# EAGLE design arduino clone (EAGLE 9.1.0)

## Sheet 1 of 4
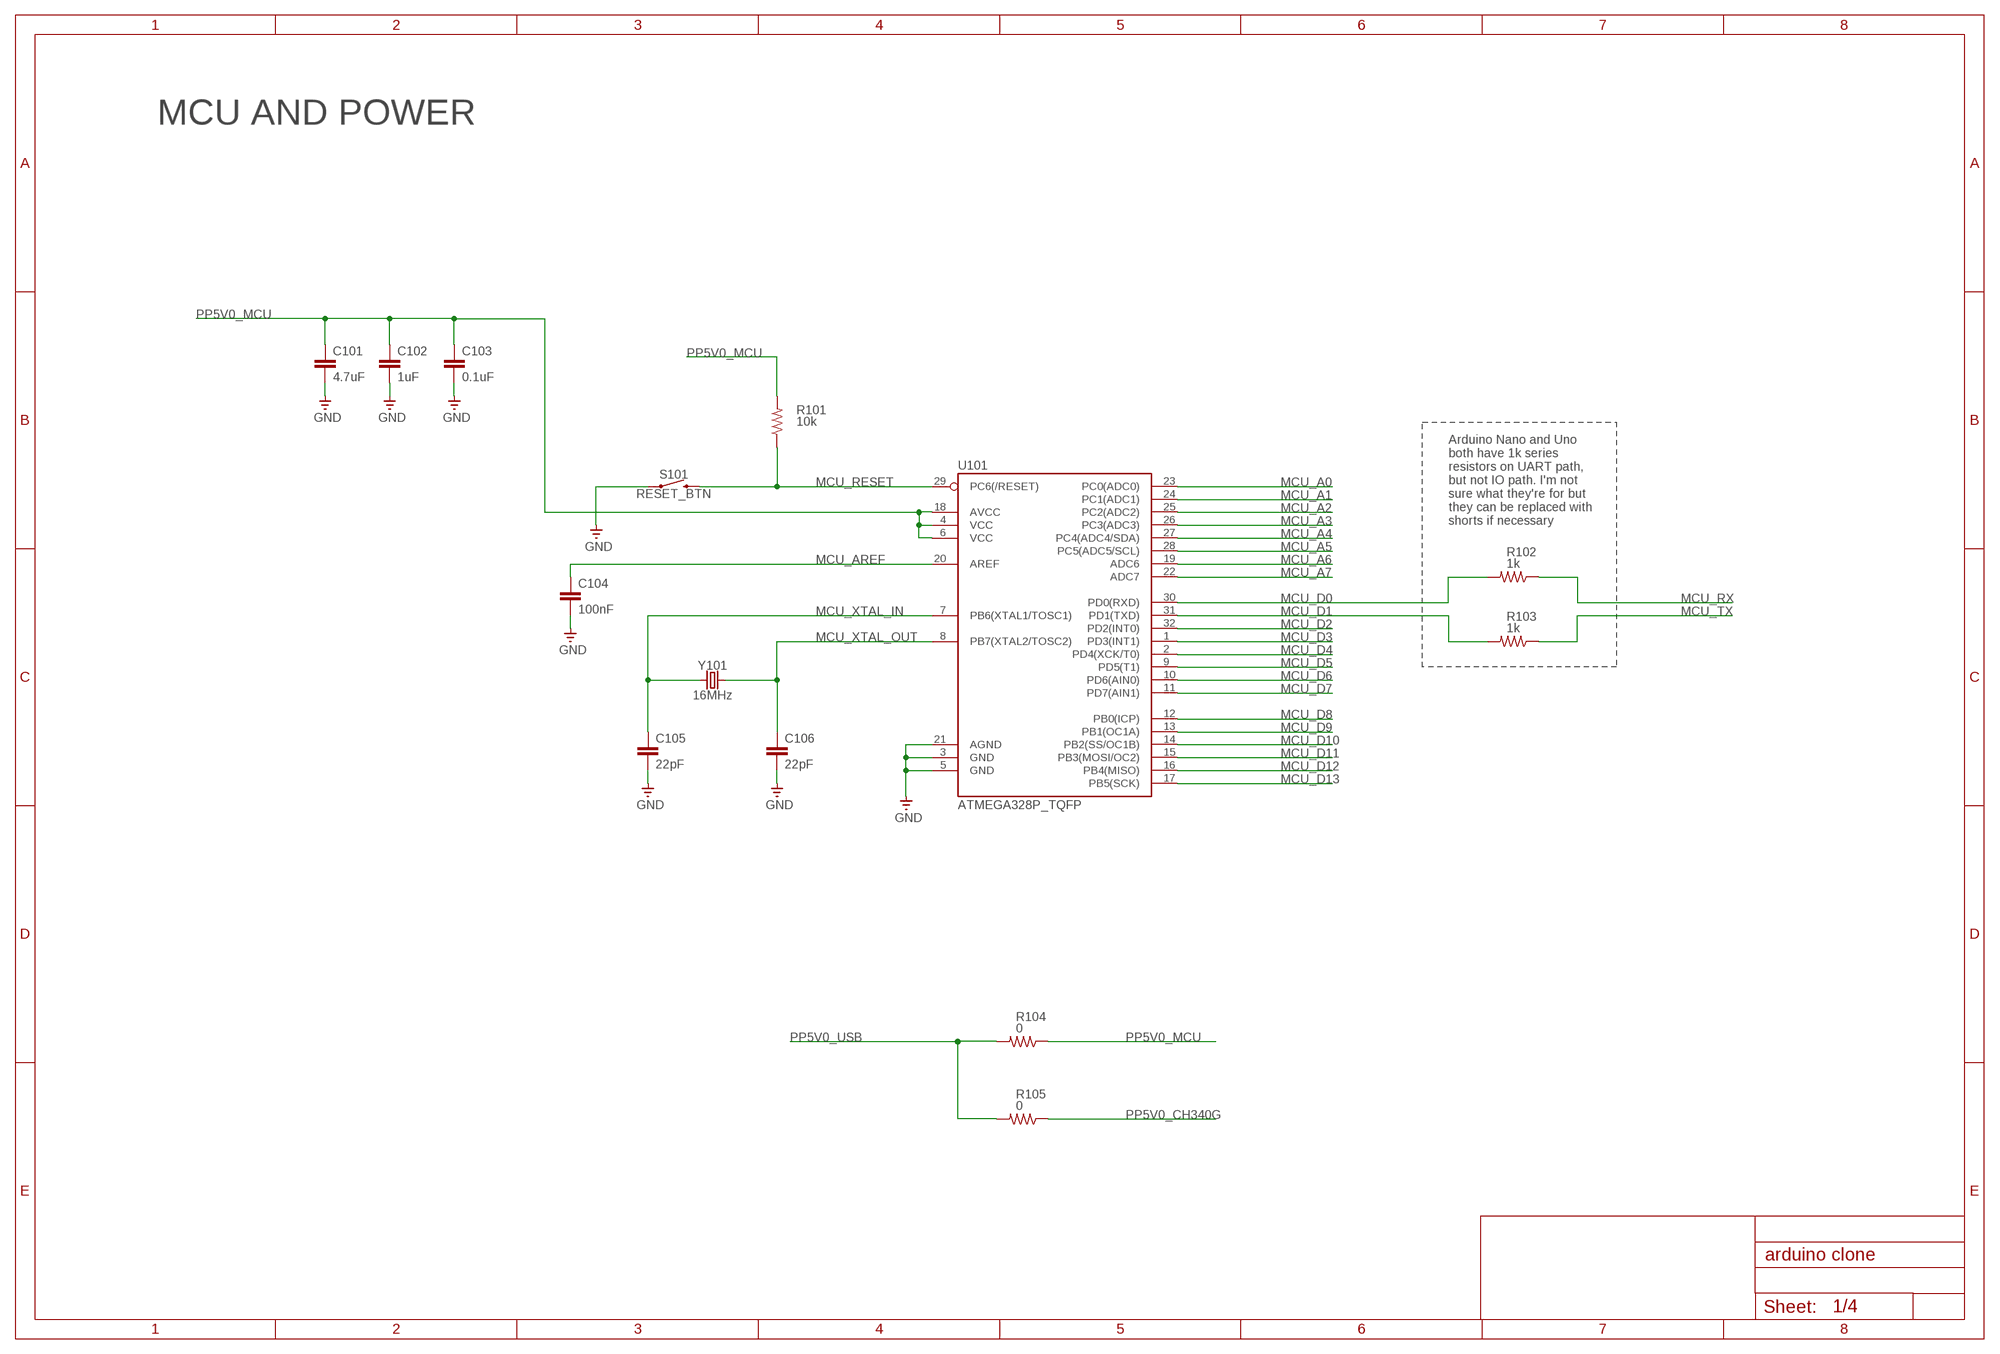
[diagram p0: schematic, sheet 1]

### Parts
C101  4.7uF  C-EUC0805  [C0805]
C102  1uF  C-EUC0805  [C0805]
C103  0.1uF  C-EUC0805  [C0805]
C104  100nF  C-EUC0805  [C0805]
C105  22pF  C-EUC0805  [C0805]
C106  22pF  C-EUC0805  [C0805]
R101  10k  R-US_R0805  [R0805]
R102  1k  R-US_R0805  [R0805]
R103  1k  R-US_R0805  [R0805]
R104  0  R-US_R0805  [R0805]
R105  0  R-US_R0805  [R0805]
S101  RESET_BTN  MOMENTARY-SWITCH-SPST-SMD-6.2MM-TALL  [TACTILE_SWITCH_SMD_6.2MM_TALL]
U101  ATMEGA328P_TQFP  [TQFP32-08]
Y101  16MHz  CRYSTAL-16MHZSMD-5X3.2  [CRYSTAL-SMD-5X3.2-4PAD]

### Nets
GND: C101.2 C102.2 C103.2 C104.2 C105.2 C106.2 S101.A2 U101.3(GND) U101.5(GND) U101.21(AGND) ; also sheet 2,3,4
MCU_A0: U101.23(PC0(ADC0)) ; also sheet 2
MCU_A1: U101.24(PC1(ADC1)) ; also sheet 2
MCU_A2: U101.25(PC2(ADC2)) ; also sheet 2
MCU_A3: U101.26(PC3(ADC3)) ; also sheet 2
MCU_A4: U101.27(PC4(ADC4/SDA)) ; also sheet 2
MCU_A5: U101.28(PC5(ADC5/SCL)) ; also sheet 2
MCU_A6: U101.19(ADC6) ; also sheet 2
MCU_A7: U101.22(ADC7) ; also sheet 2
MCU_AREF: C104.1 U101.20(AREF) ; also sheet 2
MCU_D0: R102.2 U101.30(PD0(RXD)) ; also sheet 2
MCU_D1: R103.2 U101.31(PD1(TXD)) ; also sheet 2
MCU_D2: U101.32(PD2(INT0)) ; also sheet 2
MCU_D3: U101.1(PD3(INT1)) ; also sheet 2
MCU_D4: U101.2(PD4(XCK/T0)) ; also sheet 2
MCU_D5: U101.9(PD5(T1)) ; also sheet 2
MCU_D6: U101.10(PD6(AIN0)) ; also sheet 2
MCU_D7: U101.11(PD7(AIN1)) ; also sheet 2
MCU_D8: U101.12(PB0(ICP)) ; also sheet 2
MCU_D9: U101.13(PB1(OC1A)) ; also sheet 2
MCU_D10: U101.14(PB2(SS/OC1B)) ; also sheet 2
MCU_D11: U101.15(PB3(MOSI/OC2)) ; also sheet 2
MCU_D12: U101.16(PB4(MISO)) ; also sheet 2
MCU_D13: U101.17(PB5(SCK)) ; also sheet 2
MCU_RESET: R101.1 S101.B2 U101.29(PC6(/RESET)) ; also sheet 2,3,4
MCU_RX: R102.1 ; also sheet 3,4
MCU_TX: R103.1 ; also sheet 3,4
MCU_XTAL_IN: C105.1 U101.7(PB6(XTAL1/TOSC1)) Y101.1
MCU_XTAL_OUT: C106.1 U101.8(PB7(XTAL2/TOSC2)) Y101.3
PP5V0_CH340G: R105.1 ; also sheet 3
PP5V0_MCU: C101.1 C102.1 C103.1 R101.2 R104.1 U101.4(VCC) U101.6(VCC) U101.18(AVCC) ; also sheet 2,4
PP5V0_USB: R104.2 R105.2 ; also sheet 2,3,4

### Notes on the sheet
- MCU AND POWER
- Arduino Nano and Uno 
  both have 1k series 
  resistors on UART path, 
  but not IO path. I'm not 
  sure what they're for but 
  they can be replaced with 
  shorts if necessary

## Sheet 2 of 4
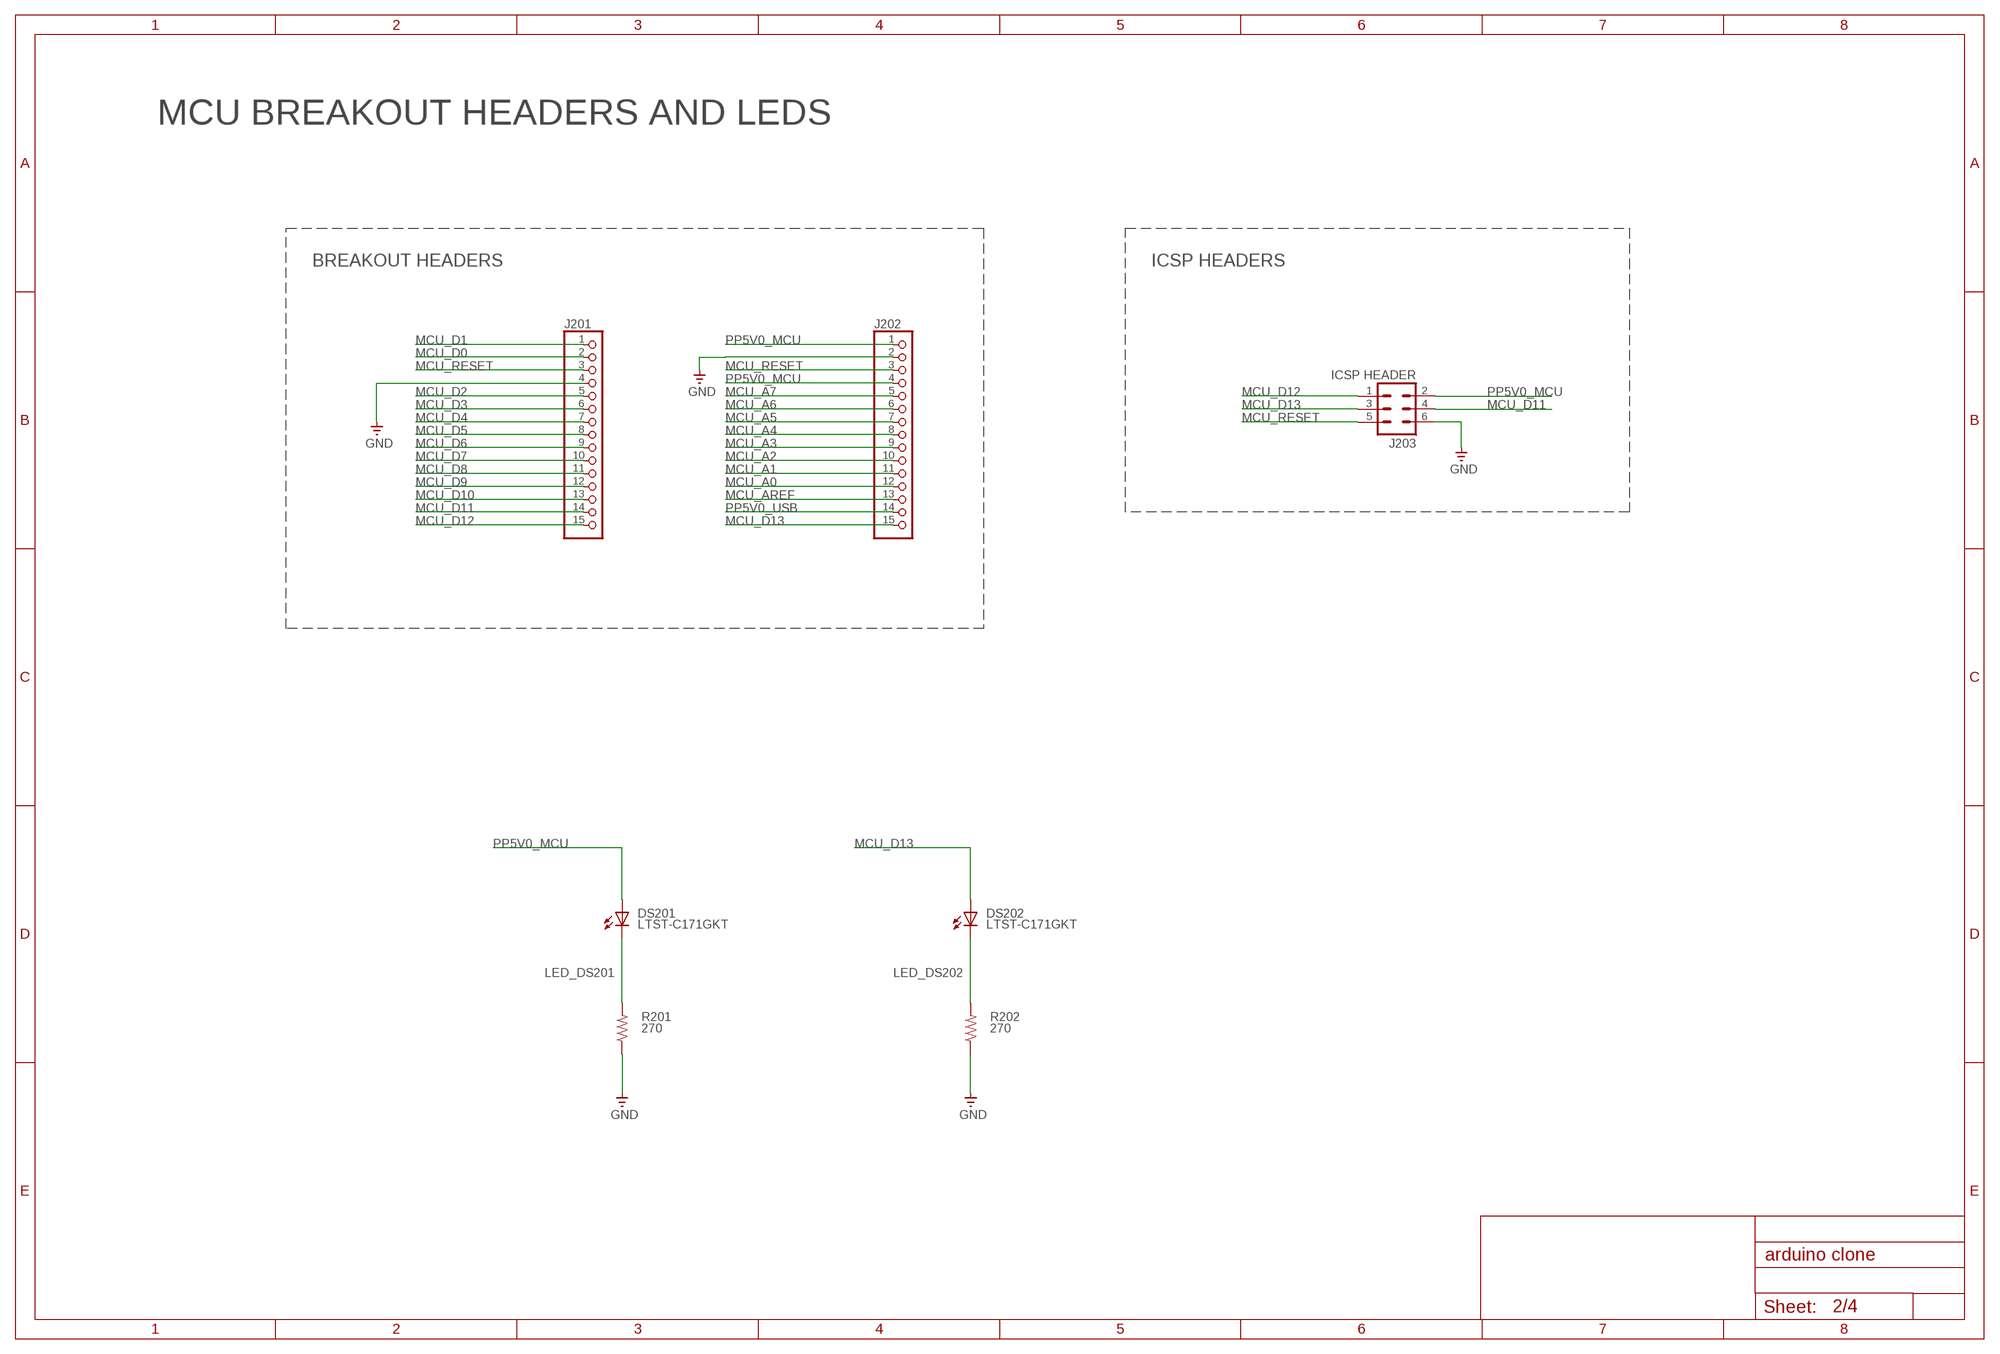
[diagram p1: schematic, sheet 2]

### Parts
DS201  LTST-C171GKT  LEDCHIPLED_0805  [CHIPLED_0805]
DS202  LTST-C171GKT  LEDCHIPLED_0805  [CHIPLED_0805]
J201  PINHD-1X15-CB  [1X15-CB]
J202  PINHD-1X15-CB  [1X15-CB]
J203  ICSP HEADER  MA03-2  [MA03-2]
R201  270  R-US_M0805  [M0805]
R202  270  R-US_M0805  [M0805]

### Nets
GND: J201.4 J202.2 J203.6 R201.1 R202.1 ; also sheet 1,3,4
LED_DS201 [BATT_POWER]: DS201.C R201.2
LED_DS202 [BATT_POWER]: DS202.C R202.2
MCU_A0: J202.12 ; also sheet 1
MCU_A1: J202.11 ; also sheet 1
MCU_A2: J202.10 ; also sheet 1
MCU_A3: J202.9 ; also sheet 1
MCU_A4: J202.8 ; also sheet 1
MCU_A5: J202.7 ; also sheet 1
MCU_A6: J202.6 ; also sheet 1
MCU_A7: J202.5 ; also sheet 1
MCU_AREF: J202.13 ; also sheet 1
MCU_D0: J201.2 ; also sheet 1
MCU_D1: J201.1 ; also sheet 1
MCU_D2: J201.5 ; also sheet 1
MCU_D3: J201.6 ; also sheet 1
MCU_D4: J201.7 ; also sheet 1
MCU_D5: J201.8 ; also sheet 1
MCU_D6: J201.9 ; also sheet 1
MCU_D7: J201.10 ; also sheet 1
MCU_D8: J201.11 ; also sheet 1
MCU_D9: J201.12 ; also sheet 1
MCU_D10: J201.13 ; also sheet 1
MCU_D11: J201.14 J203.4 ; also sheet 1
MCU_D12: J201.15 J203.1 ; also sheet 1
MCU_D13: DS202.A J202.15 J203.3 ; also sheet 1
MCU_RESET: J201.3 J202.3 J203.5 ; also sheet 1,3,4
PP5V0_MCU: DS201.A J202.1 J202.4 J203.2 ; also sheet 1,4
PP5V0_USB: J202.14 ; also sheet 1,3,4

### Notes on the sheet
- MCU BREAKOUT HEADERS AND LEDS
- BREAKOUT HEADERS | ICSP HEADERS

## Sheet 3 of 4
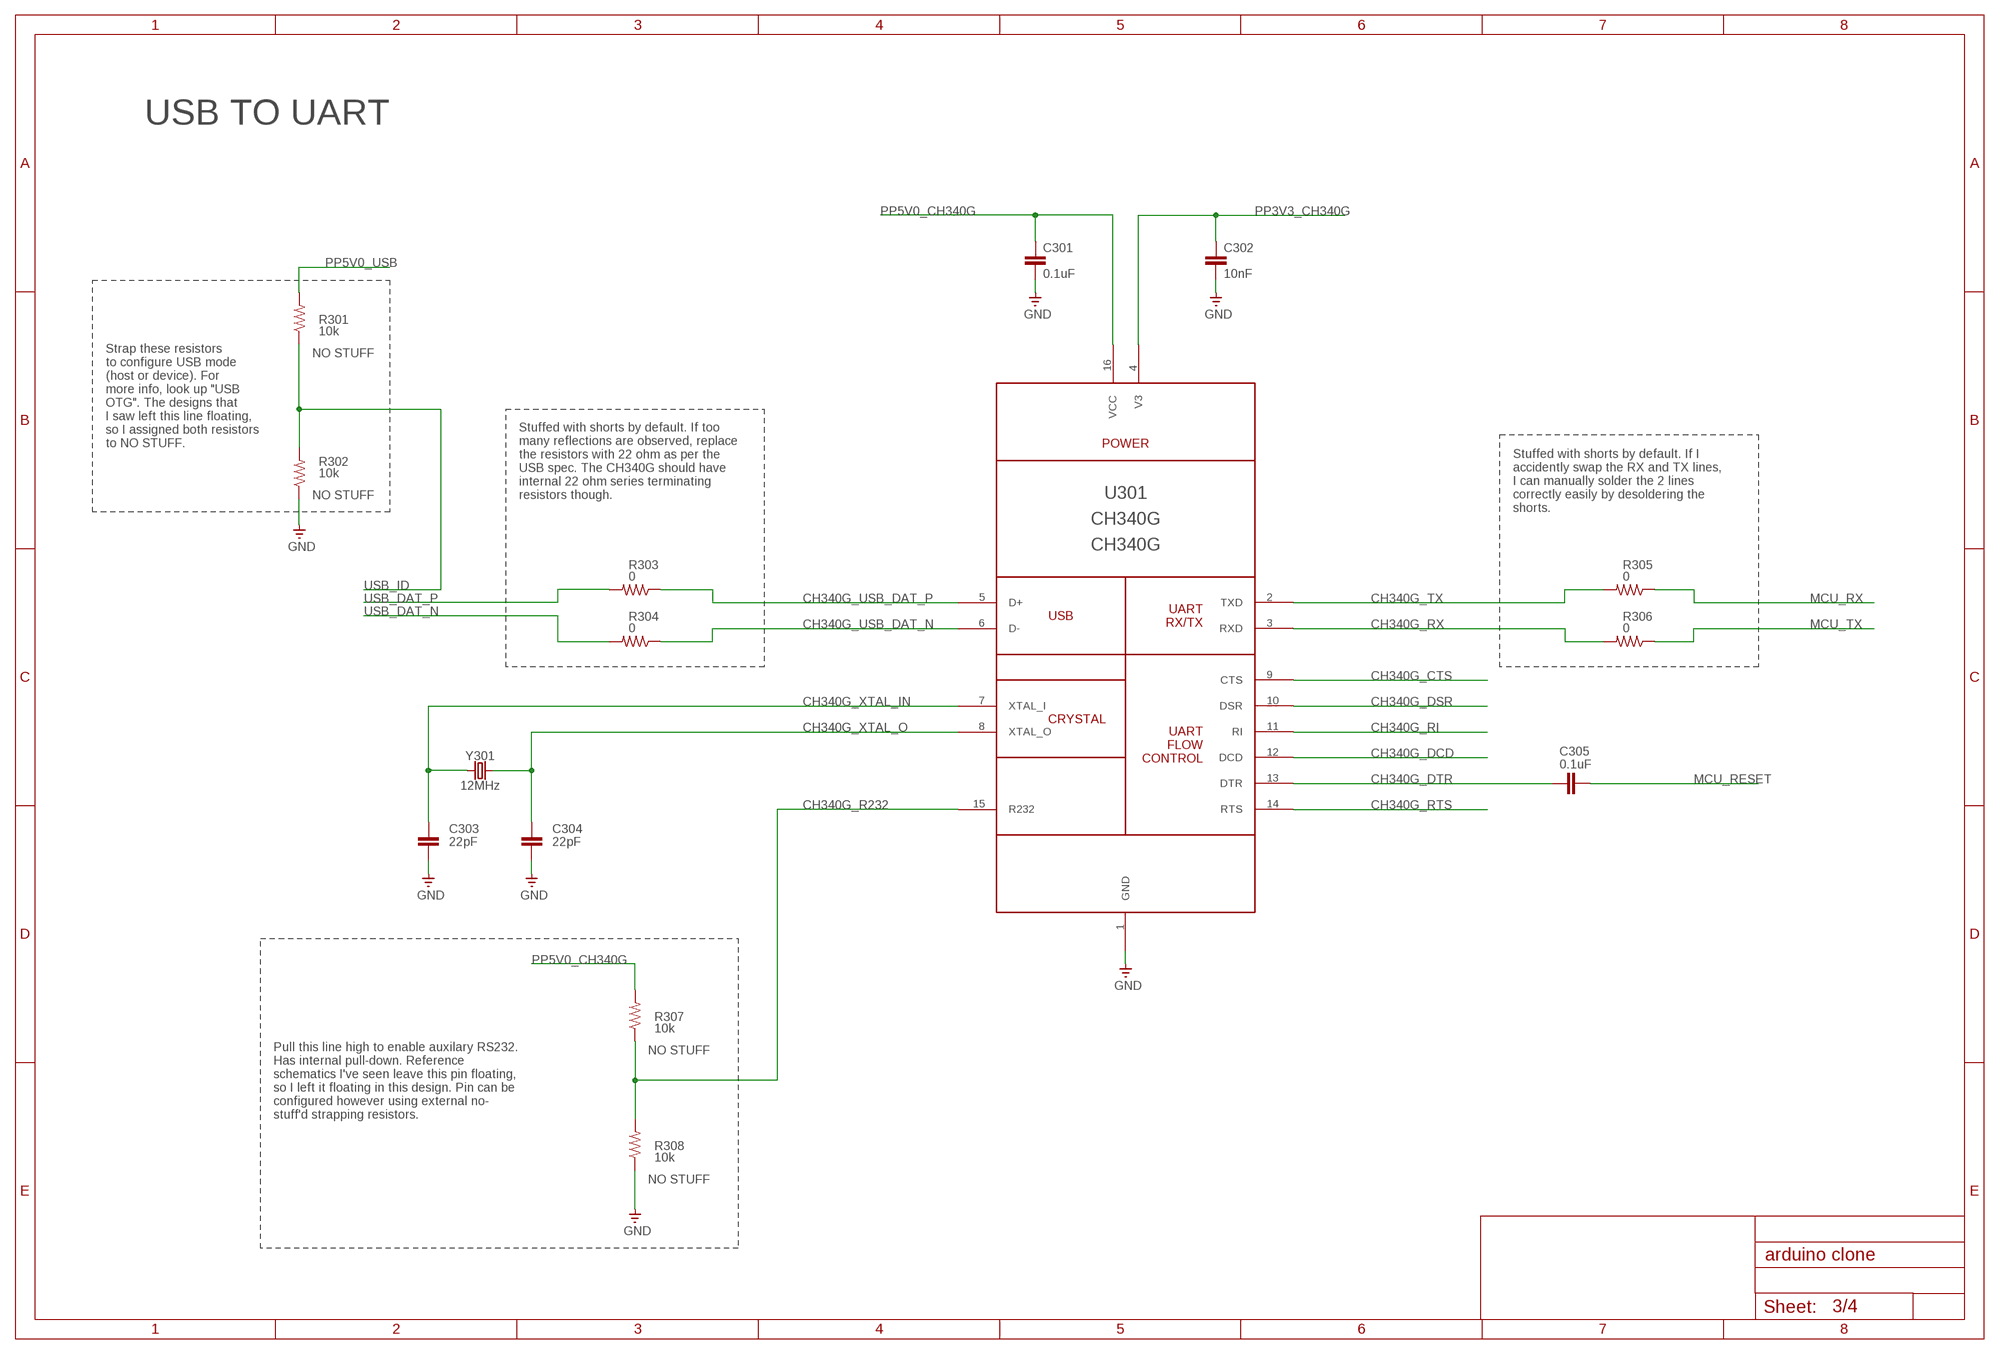
[diagram p2: schematic, sheet 3]

### Parts
C301  0.1uF  C-EUC0805  [C0805]
C302  10nF  C-EUC0805  [C0805]
C303  22pF  C-EUC0805  [C0805]
C304  22pF  C-EUC0805  [C0805]
C305  0.1uF  C-EUC0805  [C0805]
R301  10k  R-US_R0805  [R0805]
R302  10k  R-US_R0805  [R0805]
R303  0  R-US_R0805  [R0805]
R304  0  R-US_R0805  [R0805]
R305  0  R-US_R0805  [R0805]
R306  0  R-US_R0805  [R0805]
R307  10k  R-US_R0805  [R0805]
R308  10k  R-US_R0805  [R0805]
U301  CH340G  [SOIC16]
Y301  12MHz  CRYSTAL-12MHZ"  [CRYSTAL-SMD-5X3.2-4PAD]

### Nets
CH340G_CTS: U301.9(CTS) ; also sheet 4
CH340G_DCD: U301.12(DCD)
CH340G_DSR: U301.10(DSR)
CH340G_DTR: C305.1 U301.13(DTR)
CH340G_R232: R307.1 R308.2 U301.15(R232)
CH340G_RI: U301.11(RI)
CH340G_RTS: U301.14(RTS)
CH340G_RX: R306.2 U301.3(RXD)
CH340G_TX: R305.2 U301.2(TXD)
CH340G_USB_DAT_N [DIFF_PAIR_USB]: R304.1 U301.6(D-)
CH340G_USB_DAT_P [DIFF_PAIR_USB]: R303.1 U301.5(D+)
CH340G_XTAL_IN: C303.1 U301.7(XTAL_I) Y301.1
CH340G_XTAL_O: C304.1 U301.8(XTAL_O) Y301.3
GND: C301.2 C302.2 C303.2 C304.2 R302.1 R308.1 U301.1(GND) ; also sheet 1,2,4
MCU_RESET: C305.2 ; also sheet 1,2,4
MCU_RX: R305.1 ; also sheet 1,4
MCU_TX: R306.1 ; also sheet 1,4
PP3V3_CH340G: C302.1 U301.4(V3)
PP5V0_CH340G: C301.1 R307.2 U301.16(VCC) ; also sheet 1
PP5V0_USB: R301.2 ; also sheet 1,2,4
USB_DAT_N [DIFF_PAIR_USB]: R304.2 ; also sheet 4
USB_DAT_P [DIFF_PAIR_USB]: R303.2 ; also sheet 4
USB_ID: R301.1 R302.2 ; also sheet 4

### Notes on the sheet
- USB TO UART
- Strap these resistors 
  to configure USB mode 
  (host or device). For 
  more info, look up "USB 
  OTG". The designs that 
  I saw left this line floating,
  so I assigned both resistors
  to NO STUFF.
- Stuffed with shorts by default. If too 
  many reflections are observed, replace 
  the resistors with 22 ohm as per the 
  USB spec. The CH340G should have 
  internal 22 ohm series terminating 
  resistors though.
- Stuffed with shorts by default. If I 
  accidently swap the RX and TX lines, 
  I can manually solder the 2 lines 
  correctly easily by desoldering the 
  shorts.
- Pull this line high to enable auxilary RS232. 
  Has internal pull-down. Reference 
  schematics I've seen leave this pin floating,
  so I left it floating in this design. Pin can be 
  configured however using external no-
  stuff'd strapping resistors.

## Sheet 4 of 4
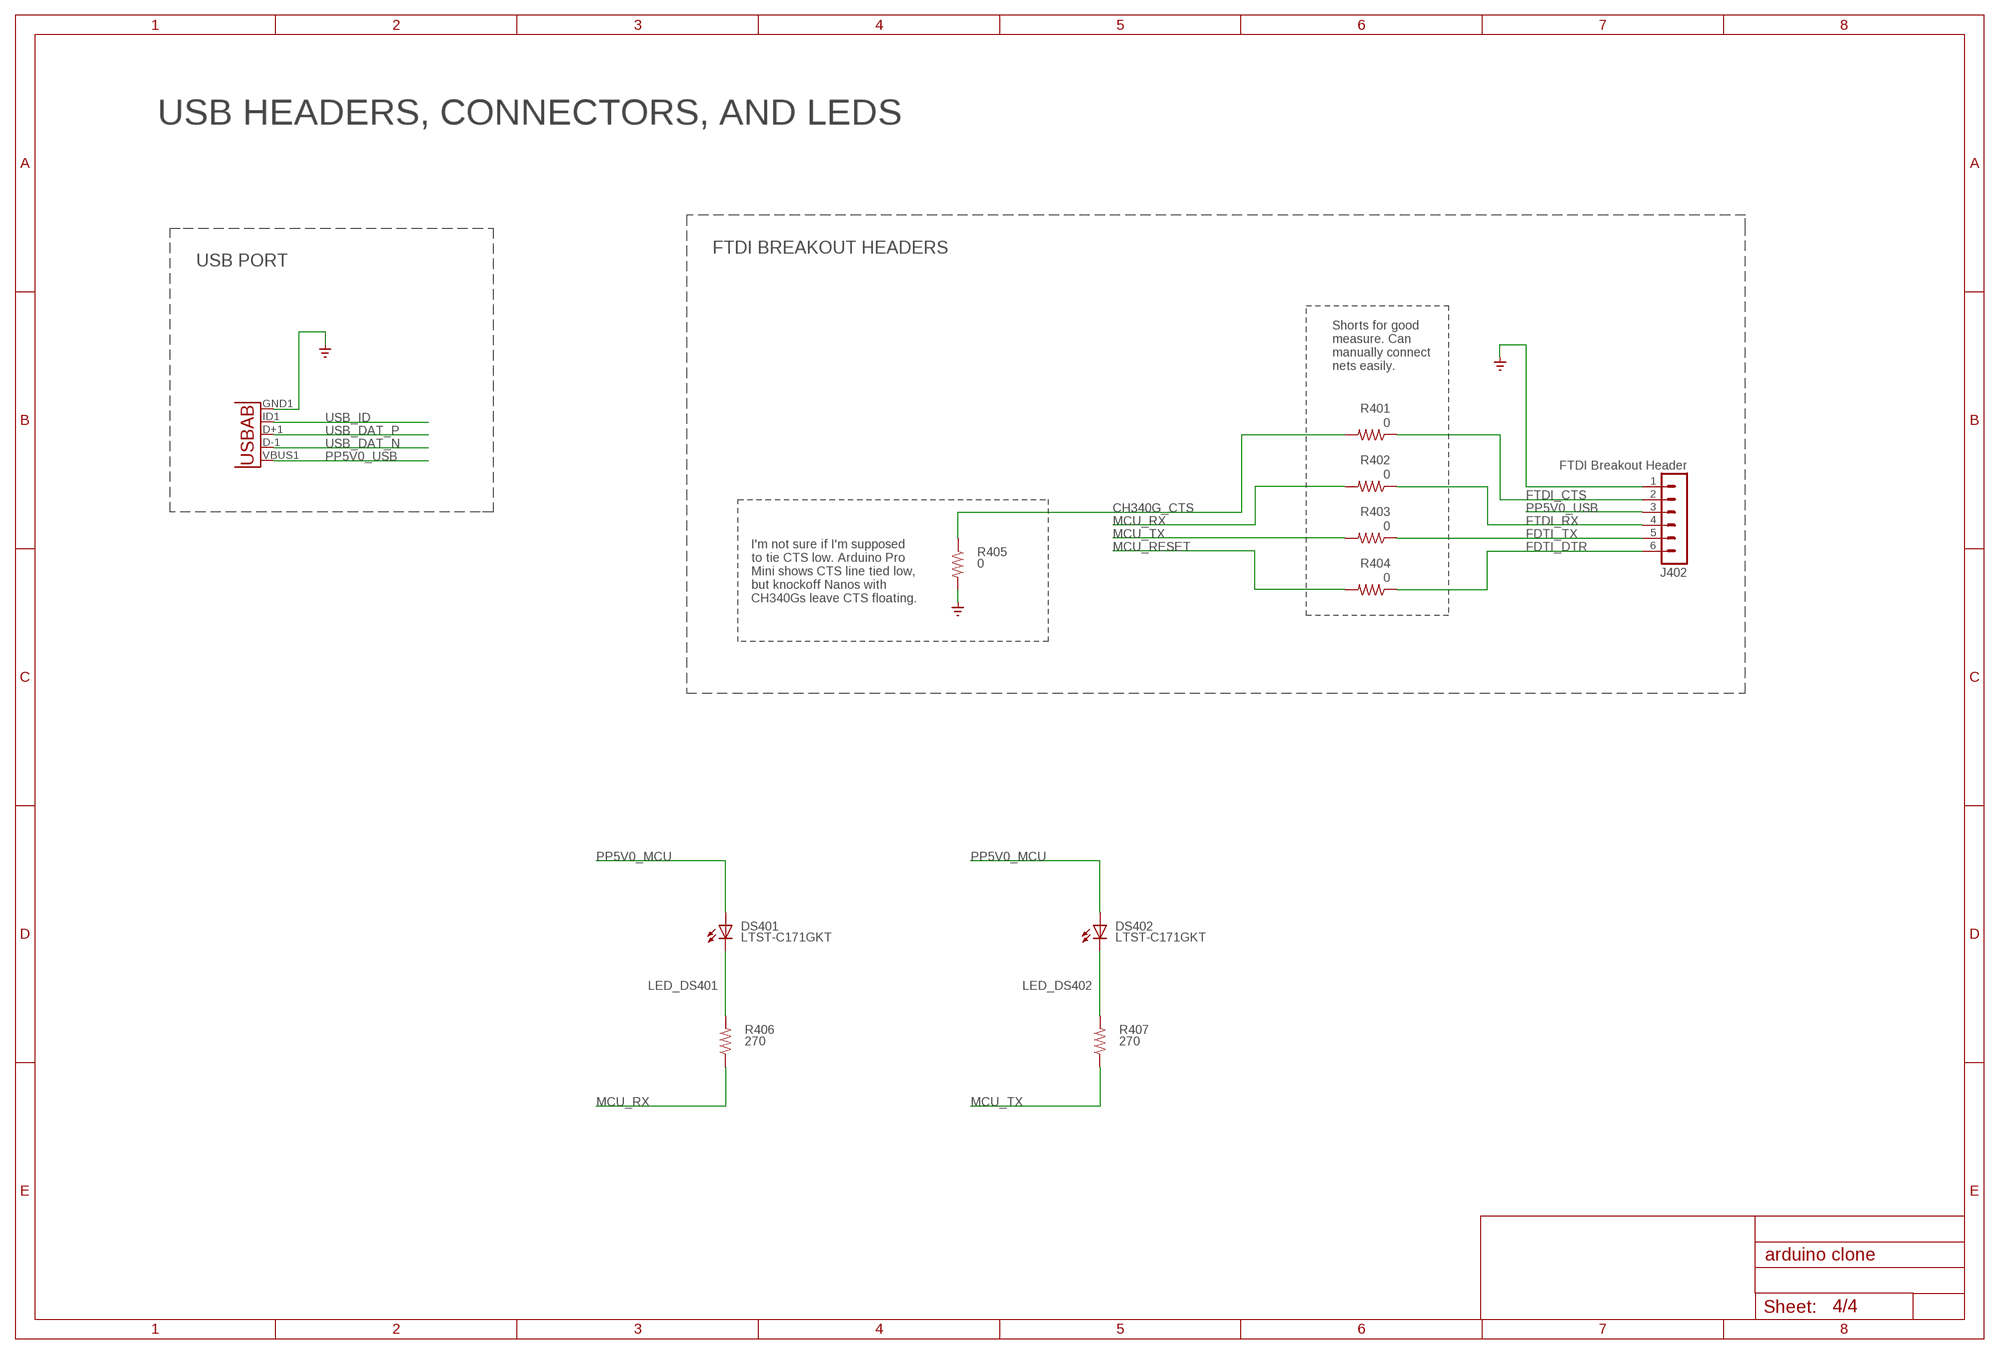
[diagram p3: schematic, sheet 4]

### Parts
DS401  LTST-C171GKT  LEDCHIPLED_0805  [CHIPLED_0805]
DS402  LTST-C171GKT  LEDCHIPLED_0805  [CHIPLED_0805]
J401  USB-ABIN&OUT  [USB-AB-MICRO-SMD-V03-IN&OUT]
J402  FTDI Breakout Header  MA06-1  [MA06-1]
R401  0  R-US_R0805  [R0805]
R402  0  R-US_R0805  [R0805]
R403  0  R-US_R0805  [R0805]
R404  0  R-US_R0805  [R0805]
R405  0  R-US_R0805  [R0805]
R406  270  R-US_M0805  [M0805]
R407  270  R-US_M0805  [M0805]

### Nets
CH340G_CTS: R401.2 R405.1 ; also sheet 3
FDTI_DTR: J402.6 R404.1
FDTI_TX: J402.5 R403.1
FTDI_CTS: J402.2 R401.1
FTDI_RX: J402.4 R402.1
GND: J401.GND1(GND) J402.1 R405.2 ; also sheet 1,2,3
LED_DS401 [BATT_POWER]: DS401.C R406.2
LED_DS402 [BATT_POWER]: DS402.C R407.2
MCU_RESET: R404.2 ; also sheet 1,2,3
MCU_RX: R402.2 R406.1 ; also sheet 1,3
MCU_TX: R403.2 R407.1 ; also sheet 1,3
PP5V0_MCU: DS401.A DS402.A ; also sheet 1,2
PP5V0_USB: J401.VBUS1(VBUS) J402.3 ; also sheet 1,2,3
USB_DAT_N [DIFF_PAIR_USB]: J401.D-1(D-) ; also sheet 3
USB_DAT_P [DIFF_PAIR_USB]: J401.D+1(D+) ; also sheet 3
USB_ID: J401.ID1(USBID) ; also sheet 3

### Notes on the sheet
- USB HEADERS, CONNECTORS, AND LEDS
- FTDI BREAKOUT HEADERS
- USB PORT
- Shorts for good
  measure. Can 
  manually connect
  nets easily.
- I'm not sure if I'm supposed 
  to tie CTS low. Arduino Pro 
  Mini shows CTS line tied low,
  but knockoff Nanos with 
  CH340Gs leave CTS floating.

## Library data of the parts
C101-C106 C301-C305 = rcl:C-EU: CAPACITOR, European symbol; SPICEPREFIX: C
DS201 DS202 DS401 DS402 = adafruit:LED: LED OSRAM: - CHIPLED LG R971, LG N971, LY N971, LG Q971, LY Q971, LO R971, LY R971 LH N974, LH R974 LS Q976, LO Q976, LY Q976 LO Q996 - Hyper CHIPLED LW Q18S LB Q993, LB Q99A, LB R99A - SideLED LS A670, LO A670, LY A670, LG A670, LP A670 LB A673, LV A673, LT A673, LW A673 LH A674 LY A675 LS A676, LA A676, LO A676, LY A676, LW A676 LS A679, LY A679, LG A679 - Hyper Micro SIDELED® LS Y876, LA Y876, LO Y876, LY Y876 LT Y87S - SmartLED LW L88C, LW L88S LB L89C, LB L89S, LG L890 LS L89K, LO L89K, LY L89K LS L896, LA L896, LO L896, LY L896 - TOPLED LS T670, LO T670, LY T670, LG T670, LP T670 LSG T670, LSP T670, LSY T670, LOP T670, LYG T670 LG T671, LOG T671, LSG T671 LB T673, LV T673, LT T673, LW T673 LH T674 LS T676, LA T676, LO T676, LY T676, LB T676, LH T676, LSB T676, LW T676 LB T67C, LV T67C, LT T67C, LS T67K, LO T67K, LY T67K, LW E67C LS E67B, LA E67B, LO E67B, LY E67B, LB E67C, LV E67C, LT E67C LW T67C LS T679, LY T679, LG T679 LS T770, LO T770, LY T770, LG T770, LP T770 LB T773, LV T773, LT T773, LW T773 LH T774 LS E675, LA E675, LY E675, LS T675 LS T776, LA T776, LO T776, LY T776, LB T776 LHGB T686 LT T68C, LB T68C - Hyper Mini TOPLED® LB M676 - Mini TOPLED Santana® LG M470 LS M47K, LO M47K, LY M47K Source: http://www.osram.convergy.de/
J201 J202 = adafruit:PINHD-1X15: PIN HEADER
J203 = con-lstb:MA03-2: PIN HEADER; OC_FARNELL: unknown; OC_NEWARK: unknown
J401 = Testing:USB-AB: This is a USB AB connector that is compatible with USB OTG. i.e. this connector can serve as a host or device
J402 = con-lstb:MA06-1: PIN HEADER; OC_FARNELL: unknown; OC_NEWARK: unknown
R101-R105 R201 R202 R303-R306 R401-R407 = adafruit:R-US_: RESISTOR, American symbol
R301 R302 R307 R308 = adafruit:R-US_: RESISTOR, American symbol; STUFF: NO STUFF
S101 = SparkFun-Switches:MOMENTARY-SWITCH-SPST: Momentary Switch (Pushbutton) - SPST Normally-open (NO) SPST momentary switches (buttons, pushbuttons). Variants PTH-12MM - 12mm square, through-hole Momentary Pushbutton Switch - 12mm Square <https://www.sparkfun.com/products/9190> (COM-09190) PTH-6.0MM, PTH-6.0MM-KIT - 6.0mm square, through-hole Mini Pushbutton Switch <https://www.sparkfun.com/products/97> (COM-00097) KIT package intended for soldering kit's - only one side of pads' copper is exposed. PTH-RIGHT-ANGLE-KIT - Right-angle, through-hole Right Angle Tactile Button <https://www.sparkfun.com/products/10791> - Used on SparkFun BigTime Watch Kit <https://www.sparkfun.com/products/11734> SMD-12MM - 12mm square, surface-mount Tactile Button - SMD (12mm) <https://www.sparkfun.com/products/12993> (COM-12993) Used on SparkFun PicoBoard <https://www.sparkfun.com/products/11888> SMD-4.5MM - 4.5mm Square Trackball Switch Used on SparkFun Blackberry Trackballer Breakout <https://www.sparkfun.com/products/13169> SMD-4.6MMX2.8MM - 4.60mm x 2.80mm, surface mount Used on SparkFun SAMD21 Mini Breakout <https://www.sparkfun.com/products/13664> SMD-5.2MM, SMD-5.2-REDUNDANT - 5.2mm square, surface-mount Mini Pushbutton Switch - SMD <https://www.sparkfun.com/products/8720> (COM-08720) Used on Arduino Pro Mini <https://www.sparkfun.com/products/11114> REDUNDANT package connects both switch circuits together SMD-6.0X3.5MM - 6.0 x 3.5mm, surface mount Momentary Reset Switch SMD <https://www.sparkfun.com/products/8229> (COM-08229) SMD-6.2MM-TALL - 6.2mm square, surface mount Tactile Button - SMD (6mm) <https://www.sparkfun.com/products/12992> Used on SparkFun Digital Sandbox <https://www.sparkfun.com/products/12651> SMD-RIGHT-ANGLE - Right-angle, surface mount Used on SparkFun Block for Intel® Edison - Arduino <https://www.sparkfun.com/products/13036>; PROD_ID: SWCH-11966; SF_SKU: COM-12992
U101 = SparkFun-IC-Microcontroller:ATMEGA328P_TQFP: Popular 328P in QFP Storefront component: ATmega328 - TQFP <https://www.sparkfun.com/products/13448> (COM-13448) Datasheet <http://www.sparkfun.com/datasheets/Components/SMD/ATMega328.pdf> SparkFun Products SparkFun RedBoard - Programmed with Arduino <https://www.sparkfun.com/products/12757> (DEV-12757) Arduino Pro Mini 328 - 5V/16MHz <https://www.sparkfun.com/products/11113> (DEV-11113) Arduino Pro Mini 328 - 3.3V/8MHz <https://www.sparkfun.com/products/11114> (DEV-11114) SparkFun OpenLog <https://www.sparkfun.com/products/13712> (DEV-13712) SparkFun MicroView - OLED Arduino Module <https://www.sparkfun.com/products/12923> (DEV-12923) SparkFun Digital Sandbox <https://www.sparkfun.com/products/12651> (DEV-12651) SparkFun PicoBoard <https://www.sparkfun.com/products/11888> (WIG-11888) Arduino Fio <https://www.sparkfun.com/products/10116> (DEV-10116) LilyPad Arduino 328 Main Board <https://www.sparkfun.com/products/13342> (DEV-13342) SparkFun RedStick <https://www.sparkfun.com/products/13741> (DEV-13741) LilyPad MP3 <https://www.sparkfun.com/products/11013> (DEV-11013) LilyPad Arduino SimpleSnap <https://www.sparkfun.com/products/10941> (DEV-10941) SparkFun Stepoko <https://www.sparkfun.com/products/13899> (ROB-13899) SparkFun Geiger Counter <https://www.sparkfun.com/products/11345> (SEN-11345) SparkFun EL Sequencer <https://www.sparkfun.com/products/12781> (COM-12781) Arduino Pro 328 - 5V/16MHz <https://www.sparkfun.com/products/10915> (DEV-10915) CryptoCape <https://www.sparkfun.com/products/12773> (DEV-12773) SparkFun IR Thermometer Evaluation Board - MLX90614 <https://www.sparkfun.com/products/10740> (SEN-10740) SparkFun RedBot Mainboard <https://www.sparkfun.com/products/12097> (ROB-12097) Arduino Pro 328 - 3.3V/8MHz <https://www.sparkfun.com/products/10914> (DEV-10914) SparkFun Block for Intel® Edison - Arduino <https://www.sparkfun.com/products/13036> (DEV-13036) SparkFun Simon Says - Surface Mount Soldering Kit <https://www.sparkfun.com/products/10935> (KIT-10935) SparkFun 7-Segment Serial Display - Red <https://www.sparkfun.com/products/11441> (COM-11441) SparkFun 7-Segment Serial Display - White <https://www.sparkfun.com/products/11629> (COM-11629) SparkFun 7-Segment Serial Display - Yellow <https://www.sparkfun.com/products/11443> (COM-11443) SparkFun 7-Segment Serial Display - Kelly Green <https://www.sparkfun.com/products/11440> (COM-11440) SparkFun 7-Segment Serial Display - Blue <https://www.sparkfun.com/products/11442> (COM-11442) SparkFun OpenSegment Serial Display - 20mm (Blue) <https://www.sparkfun.com/products/11647> (COM-11647) SparkFun OpenSegment Serial Display - 20mm (Green) <https://www.sparkfun.com/products/11646> (COM-11646) SparkFun OpenSegment Serial Display - 20mm (White) <https://www.sparkfun.com/products/11648> (COM-11648) SparkFun OpenSegment Serial Display - 20mm (Red) <https://www.sparkfun.com/products/11644> (COM-11644) SparkFun OpenSegment Serial Display - 20mm (Yellow) <https://www.sparkfun.com/products/11645> (COM-11645) SparkFun OpenSegment Shield <https://www.sparkfun.com/products/13190> (DEV-13190); PROD_ID: IC-09069
U301 = my-eagle-lib:CH340G: CH340 is a series of USB bus adapters, that provides serial, parallel or IrDA interfaces over the USB bus (note: CH340G supports serial interface only). The CH340G integrate circuit provides common MODEM signals to allow adding a UART to a computer, or converting existing UART devices to USB interface. This is a foreign component and most datasheets are in another language. Here is the best datasheet I could find. Datasheet: http://www.handsontec.com/dataspecs/ch340g.pdf Sparkfun also has datasheets on the CH340 family, but not of the CH340G. It may still prove to be useful: https://cdn.sparkfun.com/datasheets/Dev/Arduino/Other/CH340DS1.PDF
Y101 = SparkFun-Clocks:CRYSTAL-16MHZ: 16MHz Crystal Digikey Example <http://www.digikey.com/product-search/en?keywords=535-9122-1-ND> Frequency: 16MHz Frequency Stability: ±50ppm Frequency Tolerance: ±20ppm Load Capacitance: 18pF SparkFun Products: Pro Micro -5V/16MHz <https://www.sparkfun.com/products/12640> SparkFun Serial Enabled LCD Kit <https://www.sparkfun.com/products/10097>; PROD_ID: XTAL-08218; SF_ID: COM-00094
Y301 = SparkFun-Clocks:CRYSTAL-12MHZ: 12.0MHz Crystal Frequency: 12.0MHz Frequency Tolerance: ±20ppm Load Capacitance: 18pF SparkFun Products: SparkFun Logomatic <https://www.sparkfun.com/products/12772> Pocket AVR Programmer <https://www.sparkfun.com/products/9825>; PROD_ID: XTAL-08297

## Net classes
1 BATT_POWER: width 0.254 mm
2 DIFF_PAIR_USB: width 0.254 mm

## Board
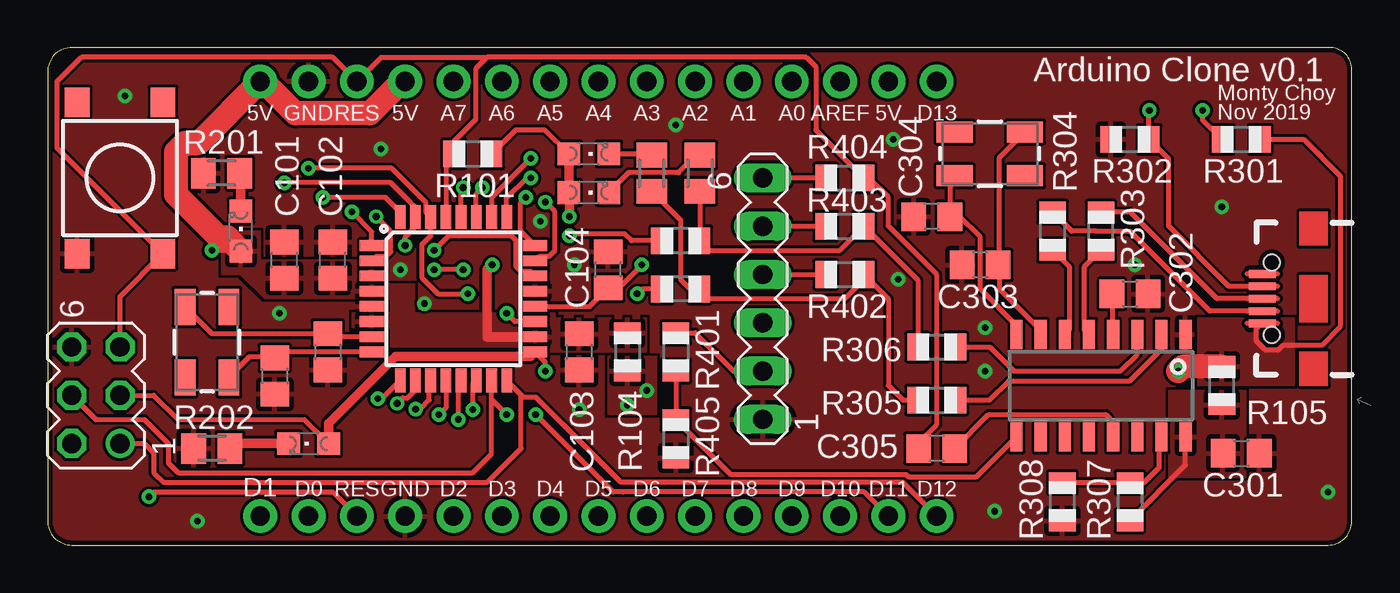
[diagram p4: board, top side]
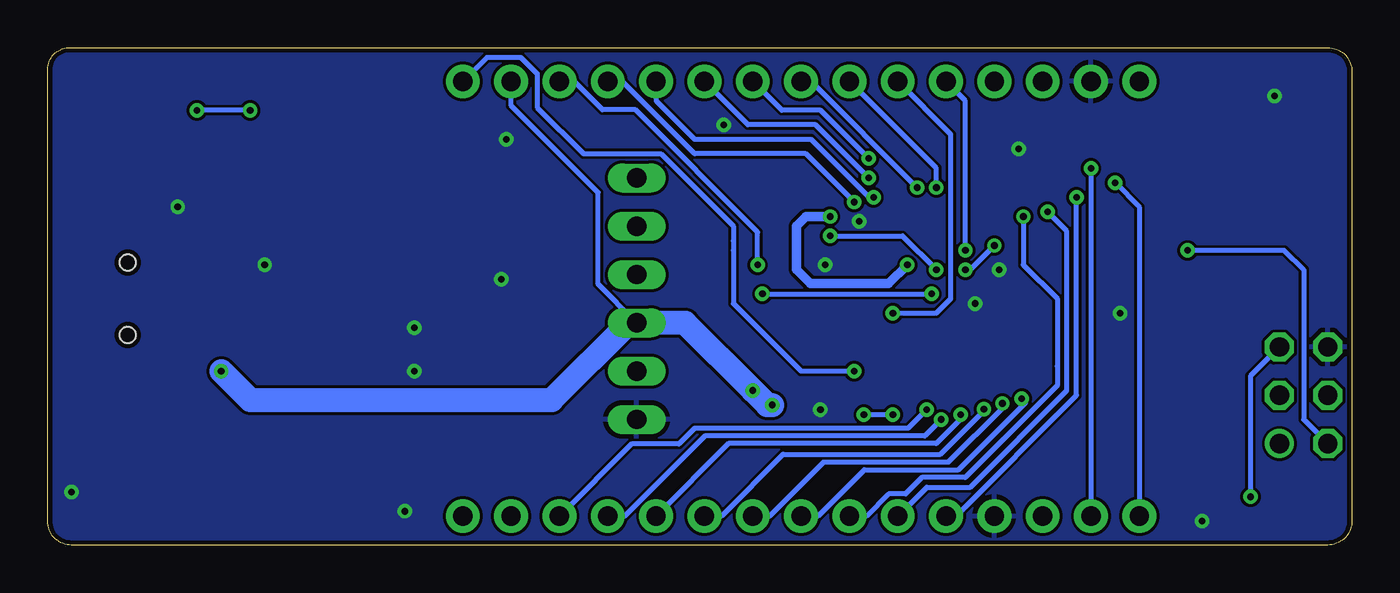
[diagram p5: board, bottom side, seen from below]

Size 68.56 x 26.16 mm. Coordinates in mm from the lower left corner, seen from the top.
Outline: 0,24.89 0,1.27 arc90 1.27,0 67.31,0 arc90 68.56,1.25 68.56,24.91 arc90 67.46,26.16 1.27,26.16 arc90 0,24.89
Copper layers (1*16): Top 0.035mm / dielectric 1.5mm / Bottom 0.035mm
Design rules "default *": minimum track width 6mil, minimum drill 0.35mm, track to track 6mil, track to pad 6mil, pad to pad 6mil, via to via 6mil, smd to smd 6mil, copper to edge 10mil, drill to drill 6mil, minimum pad ring 10mil, minimum via ring 8mil, stop-mask expansion 4mil, vias tented up to drill 0mil, thermal gap 10mil

### Footprints (pad centres in the part's own frame; a part is rotated, then mirrored left to right if it is on the bottom)
C0805 = smd 1.3 x 1.5: 1 -0.95,0; 2 0.95,0
CHIPLED_0805 = smd 1.2 x 1.2: A 0,-1.05; C 0,1.05
1X15-CB = drill 1.016 pad 1.778: 1 -17.78,0; 2 -15.24,0; 3 -12.7,0; 4 -10.16,0; 5 -7.62,0; 6 -5.08,0; 7 -2.54,0; 8 0,0; 9 2.54,0; 10 5.08,0; 11 7.62,0; 12 10.16,0; 13 12.7,0; 14 15.24,0; 15 17.78,0
MA03-2 = drill 1.016: 1 -2.54,-1.27 | drill 1.016 octagon: 2 -2.54,1.27; 3 0,-1.27; 4 0,1.27; 5 2.54,-1.27; 6 2.54,1.27
USB-AB-MICRO-SMD-V03-IN&OUT = smd 1.4 x 0.4: D+1 2.7,0; D-1 2.7,0.65; GND1 2.7,-1.3; ID1 2.7,-0.65; VBUS1 2.7,1.3 | hole 0.85: 2.2,1.9; 2.2,-1.9
MA06-1 = drill 1.016 long: 1 -6.35,0; 2 -3.81,0; 3 -1.27,0; 4 1.27,0; 5 3.81,0; 6 6.35,0
R0805 = smd 1.1 x 1.4: 1 -1,0; 2 1,0
M0805 = smd 1.3 x 1.6: 1 -0.95,0; 2 0.95,0
TACTILE_SWITCH_SMD_6.2MM_TALL = smd 1.55 x 1.3: A1 -3.975,-2.25; A2 3.975,-2.25; B1 -3.975,2.25; B2 3.975,2.25
TQFP32-08 = smd 1.27 x 0.559: 1 -4.293,2.8; 2 -4.293,2; 3 -4.293,1.2; 4 -4.293,0.4; 5 -4.293,-0.4; 6 -4.293,-1.2; 7 -4.293,-2; 8 -4.293,-2.8; 17 4.293,-2.8; 18 4.293,-2; 19 4.293,-1.2; 20 4.293,-0.4; 21 4.293,0.4; 22 4.293,1.2; 23 4.293,2; 24 4.293,2.8 | smd 0.559 x 1.27: 9 -2.8,-4.293; 10 -2,-4.293; 11 -1.2,-4.293; 12 -0.4,-4.293; 13 0.4,-4.293; 14 1.2,-4.293; 15 2,-4.293; 16 2.8,-4.293; 25 2.8,4.293; 26 2,4.293; 27 1.2,4.293; 28 0.4,4.293; 29 -0.4,4.293; 30 -1.2,4.293; 31 -2,4.293; 32 -2.8,4.293
SOIC16 = smd 0.635 x 1.524: 1 -4.445,-2.695; 2 -3.175,-2.695; 3 -1.905,-2.695; 4 -0.635,-2.695; 5 0.635,-2.695; 6 1.905,-2.695; 7 3.175,-2.695; 8 4.445,-2.695; 9 4.445,2.695; 10 3.175,2.695; 11 1.905,2.695; 12 0.635,2.695; 13 -0.635,2.695; 14 -1.905,2.695; 15 -3.175,2.695; 16 -4.445,2.695
CRYSTAL-SMD-5X3.2-4PAD = smd 1.9 x 1.1: 1 -1.85,-1.15; 2 1.85,-1.15; 3 1.85,1.15; 4 -1.85,1.15

### Placement (x,y rotation side)
C101  12.45,14.99 90 top
C102  14.99,14.99 90 top
C103  27.94,10.16 270 top
C104  29.46,14.48 90 top
C105  14.73,10.16 270 top
C106  11.94,8.89 270 top
C301  62.74,4.83 0 top
C302  56.9,13.21 0 top
C303  49.02,14.73 180 top
C304  46.48,17.27 180 top
C305  46.74,5.08 180 top
DS201  10.16,16.51 0 top
DS202  13.72,5.33 90 top
DS401  28.45,20.57 270 top
DS402  28.45,18.54 270 top
J201  28.96,1.52 0 top
J202  28.96,24.38 0 top
J203  2.54,7.87 90 top
J401  66.55,12.95 180 top
J402  37.59,12.95 90 top
R101  22.35,20.57 0 top
R102  33.27,13.46 180 top
R103  33.27,16 180 top
R104  30.48,10.16 270 top
R105  61.72,8.38 90 top
R201  9.14,19.56 0 top
R202  8.64,5.08 0 top
R301  62.74,21.34 0 top
R302  56.9,21.34 0 top
R303  55.37,16.51 90 top
R304  52.83,16.51 90 top
R305  46.74,7.62 0 top
R306  46.74,10.41 0 top
R307  56.9,2.29 270 top
R308  53.34,2.29 90 top
R401  33.02,10.16 270 top
R402  41.91,14.22 0 top
R403  41.91,16.76 0 top
R404  41.91,19.3 0 top
R405  33.02,5.59 270 top
R406  31.75,19.56 90 top
R407  34.29,19.56 90 top
S101  3.81,19.3 270 top
U101  21.34,12.95 0 top
U301  55.37,8.38 180 top
Y101  8.38,10.67 270 top
Y301  49.53,20.57 180 top

### Tracks (layer width: path | path; a pad name or v marks a point on that pad's centre or on a via)
CH340G_CTS
  Top 0.254: R401.2 R405.1 35.9,3.71 45.13,3.71 45.24,3.59 48.83,3.59 U301.9
CH340G_DTR
  Top 0.254: C305.1 49.46,6.86 55.63,6.86 56.01,6.48 U301.13
CH340G_R232
  Top 0.254: R308.2 R307.1 57.64,3.29 58.42,4.06 58.42,5.56 U301.15
CH340G_RX
  Top 0.254: R306.2 49.53,10.41 50.8,9.14 56.39,9.14 57.28,10.03 U301.3
CH340G_TX
  Top 0.254: U301.2 58.55,10.29 56.9,8.64 50.53,8.64 49.51,7.62 R305.2
CH340G_USB_DAT_N
  Top 0.254: R304.1 53.72,14.62 53.72,11.33 U301.6
CH340G_USB_DAT_P
  Top 0.254: R303.1 54.48,14.62 54.48,11.33 U301.5
CH340G_XTAL_IN
  Top 0.254: Y301.1 50.04,20.38 50.04,14.8 C303.1 50.04,14.67 50.04,13.46 51.05,12.45 52.2,11.3 U301.7
CH340G_XTAL_O
  Top 0.254: Y301.3 47.43,19.18 C304.1 47.94,17.27 49.02,16.19 49.02,13.46 50.93,11.56 U301.8
FDTI_DTR
  Top 0.254: R404.1 J402.6
FDTI_TX
  Top 0.254: J402.5 R403.1
FTDI_CTS
  Top 0.254: R401.1 34.04,11.16 36.05,9.14 J402.2
FTDI_RX
  Top 0.254: J402.4 R402.1
GND  (via drill 0.35)
  other vias: 17.53,20.83 12.19,12.19 18.54,14.48 27.94,7.11 27.69,14.73 33.02,22.1 19.81,12.7 44.7,13.97 49.28,9.14 25.91,17.02 67.31,2.79 61.72,17.78 57.15,14.73 49.28,11.43 44.45,21.34 49.78,1.78 4.06,23.62 7.87,1.27
  pour Top (rank 6): -2.29,27.43 69.34,27.43 69.34,-2.29 -2.29,-2.29
  pour Bottom (rank 6): -2.03,27.18 -2.03,-2.03 69.09,-2.03 69.09,27.18
LED_DS201
  Top 0.508: R201.2 10.16,19.49 DS201.C
LED_DS202
  Top 0.508: DS202.C 9.84,5.33 R202.2
LED_DS401
  Top 0.254: DS401.C 31.68,20.57 R406.2
LED_DS402
  Top 0.254: R407.2 34.1,20.51 33.17,19.58 30.53,19.58 DS402.C
MCU_A0  (via drill 0.35)
  Top 0.254: U101.23 25.87,15.2 26.38,15.2 26.67,15.49 26.67,17.53 v26.16,18.03
  Bottom 0.254: v26.16,18.03 28.7,20.57 34.54,20.57 38.35,24.38 J202.12
MCU_A1  (via drill 0.35)
  Top 0.254: U101.24 24.87,16.52 24.87,18.01 v25.15,18.29
  Bottom 0.254: v25.15,18.29 25.4,18.29 28.45,21.34 34.54,21.34 36.58,23.37 J202.11
MCU_A2  (via drill 0.35)
  Top 0.254: U101.25 24.14,18.26 25.18,19.3 v25.4,19.3
  Bottom 0.254: v25.4,19.3 28.19,22.1 31.75,22.1 J202.10
MCU_A3  (via drill 0.35)
  Top 0.254: U101.26 23.37,17.28 23.37,18.3 v25.39,20.33
  Bottom 0.254: v25.39,20.33 27.92,22.86 29.97,22.86 J202.9
MCU_A4  (via drill 0.35)
  Top 0.254: U101.27 22.54,18.47 v22.86,18.8
  Bottom 0.254: J202.8 28.45,24.38 v22.86,18.8
MCU_A5  (via drill 0.35)
  Top 0.254: U101.28 21.74,18.69 v21.84,18.8
  Bottom 0.254: v21.84,18.8 21.84,19.81 J202.7
MCU_A6  (via drill 0.35)
  Top 0.254: U101.19 24.57,11.75 v24.13,12.19
  Bottom 0.254: v24.13,12.19 21.84,12.19 21.08,12.95 21.08,21.59 J202.6
MCU_A7  (via drill 0.35)
  Top 0.254: v20.32,15.49 21.08,16.26 24.38,16.26 24.64,16 24.64,14.63 24.88,14.4 25.39,14.4 U101.22
  Bottom 0.254: v20.32,15.49 20.32,23.37 J202.5
MCU_AREF  (via drill 0.35)
  Top 0.254: U101.20 28.49,12.55 C104.1 30.04,13.53 v31.24,14.73
  Bottom 0.254: J202.13 40.89,24.38 39.39,22.88 37.67,22.88 31.24,16.46 v31.24,14.73
MCU_D0  (via drill 0.35)
  Top 0.254: R102.2 31.24,13.46 v30.99,13.21 | v22.1,13.21 20.53,13.21 19.66,14.07 19.66,15.77 20.14,16.24 U101.30 19.89,17.49 19.89,18 18.08,19.81 v13.72,19.81
  Bottom 0.254: v30.99,13.21 v22.1,13.21 | v13.72,19.81 J201.2
MCU_D1  (via drill 0.35)
  Top 0.254: R103.2 30.69,16 30.33,16.36 27.69,16.36 27.53,16.36 v27.43,16.26 | v21.84,14.48 v20.32,14.48 | v18.8,15.75 18.8,16.2 19.35,16.75 19.35,17.23 U101.31 19.34,17.76 19.09,18 18.04,19.05 v12.45,19.05
  Bottom 0.254: v27.43,16.26 23.62,16.26 v21.84,14.48 | v20.32,14.48 20.07,14.48 v18.8,15.75 | v12.45,19.05 11.18,17.78 J201.1
MCU_D2  (via drill 0.35)
  Top 0.254: v14.48,18.29 17.75,18.29 18.54,17.5 U101.32
  Bottom 0.254: v14.48,18.29 14.48,7.87 20.83,1.52 J201.5
MCU_D3  (via drill 0.35)
  Top 0.254: U101.1 17.04,16.48 v16,17.53
  Bottom 0.254: J201.6 22.35,3.05 20.07,3.05 14.99,8.13 14.99,16.51 v16,17.53
MCU_D4  (via drill 0.35)
  Top 0.254: U101.2 17.29,15.2 17.79,15.2 18.03,15.44 18.03,16.44 17.98,16.5 17.98,16.57 v17.27,17.27
  Bottom 0.254: 15.49,9.4 15.49,12.95 17.27,14.73 v17.27,17.27 | 15.49,9.4 | 15.49,9.4 15.49,8.38 20.32,3.56 22.61,3.56 23.47,2.69 24.36,2.69 25.53,1.52 J201.7
MCU_D5  (via drill 0.35)
  Top 0.254: v17.36,7.7 17.58,7.7 U101.9
  Bottom 0.254: J201.8 28.07,1.52 25.63,3.96 20.68,3.96 17.14,7.49 v17.36,7.7
MCU_D6  (via drill 0.35)
  Top 0.254: v18.37,7.45 18.67,7.75 18.93,7.75 19.34,8.15 U101.10
  Bottom 0.254: J201.9 30.61,1.52 27.76,4.37 21.2,4.37 18.37,7.2 v18.37,7.45
MCU_D7  (via drill 0.35)
  Top 0.254: U101.11 20.07,8.59 | 20.07,8.59 | v19.34,7.15 19.6,7.15 20.07,7.62 20.07,8.59
  Bottom 0.254: J201.10 33.15,1.52 29.9,4.77 21.64,4.77 19.3,7.11 v19.34,7.15
MCU_D8  (via drill 0.35)
  Top 0.254: U101.12 20.94,7.22 v20.57,6.86
  Bottom 0.254: J201.11 32.77,5.33 21.84,5.33 20.57,6.6 v20.57,6.86
MCU_D9  (via drill 0.35)
  Top 0.254: v21.59,6.6 21.59,7.11 21.59,8.52 U101.13
  Bottom 0.254: v21.59,6.6 22.45,5.74 34.01,5.74 38.23,1.52 J201.12
MCU_D10  (via drill 0.35)
  Top 0.254: U101.14 22.35,8.48 22.35,7.11 v22.36,7.12
  Bottom 0.254: v22.36,7.12 23.33,6.15 34.54,6.15 35.38,5.31 37.87,5.31 J201.13
MCU_D11  (via drill 0.35)
  Top 0.254: J203.4 2.54,6.6 5.08,6.6 6.35,5.33 6.35,4.32 6.86,3.81 22.35,3.81 23.34,4.79 23.34,7.65 | 23.34,7.65 23.34,8.38 U101.15 | J201.14 42.93,2.79 30.23,2.79 29.72,2.79 v25.65,6.86 | v24.13,6.86 23.34,7.65
  Bottom 0.254: v25.65,6.86 v24.13,6.86
MCU_D12
  Top 0.254: J203.1 5.08,5.33 5.59,4.83 5.59,3.81 6.1,3.3 23.11,3.3 24.9,5.09 24.9,7.9 U101.16 25.03,7.77 25.67,7.77 30.14,3.3 44.96,3.3 J201.15
MCU_D13  (via drill 0.35)
  Top 0.254: DS202.A 13.5,6.6 6.86,6.6 5.59,7.87 J203.3 | U101.17 26.16,9.62 v26.16,9.14
  Top 0.508: U101.17 25.38,9.91 18.29,9.91 14.77,6.39 DS202.A
  Bottom 0.254: J202.15 45.47,25.65 43.69,25.65 42.82,24.79 42.82,23.01 40.39,20.57 36.32,20.57 32.51,16.76 32.51,16 32.51,15.49 32.51,12.7 28.96,9.14 v26.16,9.14
MCU_RESET  (via drill 0.35)
  Top 0.254: J203.5 3.81,13.08 S101.B2 0.51,20.88 0.51,24.38 1.78,25.65 14.99,25.65 J202.3 17.53,25.65 23.11,25.65 | U101.29 20.94,20.16 R101.1 21.35,21.22 22.5,22.38 22.5,25.04 23.11,25.65 | C305.2 45.79,5.4 46.74,6.35 46.74,14.22 44.2,16.76 44.2,18.29 43.18,19.3 R404.2 40.39,21.83 40.39,25.15 39.88,25.65 23.11,25.65 | J201.3 14.99,2.79 5.59,2.79 v5.33,2.54
  Bottom 0.254: J203.5 5.33,8.89 v5.33,2.54
MCU_RX
  Top 0.254: R402.2 43.05,14.09 | 43.05,14.09 44.2,12.94 44.2,8.38 44.96,7.62 R305.1 | 43.05,14.09 41.91,12.95 34.78,12.95 34.27,12.95 | R406.1 33.27,17.08 33.27,13.95 34.27,12.95 | R102.1 34.27,12.95
MCU_TX
  Top 0.254: R306.1 45.74,13.94 R403.2 41.64,15.49 34.78,15.49 R103.1 34.29,16.02 R407.1
MCU_XTAL_IN
  Top 0.254: U101.7 14.89,10.95 C105.1 8.64,11.11 Y101.1
MCU_XTAL_OUT
  Top 0.254: U101.8 12.25,10.15 C106.1 11.87,9.91 10.62,9.91 Y101.3
PP3V3_CH340G
  Top 0.254: U301.4 56.01,13.15 C302.1
PP5V0_CH340G
  Top 0.254: R307.2 59.82,4.21 U301.16
  pour Top (rank 2): 60.45,8.13 62.99,8.13 62.99,3.56 58.93,3.56 58.93,8.13
PP5V0_MCU  (via drill 0.35)
  Top 0.254: DS201.A 10.13,15.49 v8.64,15.49 | R101.2 24.62,21.84 26.13,21.84 DS401.A
  Top 0.508: DS401.A DS402.A 27.43,18.51 v27.43,17.27 | U101.18 23.11,10.95 23.11,14.48 v23.37,14.73
  Top 1.27: DS201.A 9.45,16.17 9.02,16.17 6.76,18.43 6.76,20.68 7.22,21.15 7.94,21.15 J202.1 11.34,24.38 13.02,22.71 16.95,22.71 18.63,24.38 J202.4
  Bottom 0.254: v8.64,15.49 3.56,15.49 2.54,14.48 2.54,6.6 J203.2
  Bottom 0.508: v23.37,14.73 24.36,13.74 28.47,13.74 29.21,14.48 29.21,16.76 28.7,17.27 v27.43,17.27
  pour Top: 9.91,16.51 11.18,16.51 11.18,14.99 16.26,14.99 16.26,13.72 19.3,13.72 19.3,12.19 26.67,12.19 26.67,11.94 31.5,11.94 31.5,11.43 31.5,10.41 31.5,10.16 26.42,10.16 26.42,10.41 19.81,10.41 18.03,10.41 18.03,11.43 16,11.43 16,12.19 18.03,12.19 18.03,12.95 16,12.95 15.24,12.95 13.46,12.95 11.43,12.95 10.16,14.22 9.14,14.22 9.14,16.51 9.65,16.51
PP5V0_USB  (via drill 0.35)
  Top 0.254: R301.2 66.02,21.34 67.95,19.41 67.95,11.48 66.97,10.5 64.94,10.5 64.68,10.25 64.01,10.25 63.54,10.72 63.54,11.39 63.83,11.67
  Top 1.27: R105.2 59.67,9.38 v59.44,9.14
  Bottom 0.254: J402.3 39.62,13.72 39.62,18.54 44.2,23.11 J202.14
  Bottom 1.27: v30.48,7.37 30.73,7.37 v31.5,8.13 35.05,11.68 J402.3 38.01,11.68 42.07,7.62 57.91,7.62 v59.44,9.14
  pour Top: 61.21,8.38 65.53,8.38 65.53,11.94 60.45,11.94 60.45,8.38
  pour Top: 29.46,9.91 29.46,6.86 32,6.86 32,9.91
USB_DAT_N
  Top 0.254: J401.D-1 61.1,12.3 59.18,14.22 57.66,15.75 56.9,16.51 55.12,16.51 | R304.2 53.83,16.51 55.12,16.51 | 55.12,16.51
USB_DAT_P
  Top 0.254: J401.D+1 61.47,12.95 59.18,15.24 56.91,17.51 R303.2
USB_ID  (via drill 0.35)
  Top 0.254: J401.ID1 62.09,13.6 58.93,16.76 58.93,20.3 R302.2 57.9,22.84 v57.91,22.86 | v60.71,22.86 60.71,22.37 R301.1
  Bottom 0.254: v57.91,22.86 v60.71,22.86

### Text on the board
tPlace: Arduino Clone v0.1 | 5V | GND | RES | 5V | A7 | A6 | A5 | A4 | A3 | A2 | A1 | A0 | AREF | 5V | D13 | Monty Choy | Nov 2019 | D1 | D0 | RES | GND | D2 | D3 | D4 | D5 | D6 | D7 | D8 | D9 | D10 | D11 | D12